# EAGLE design kicker-v2.2 (EAGLE 9.1.3)
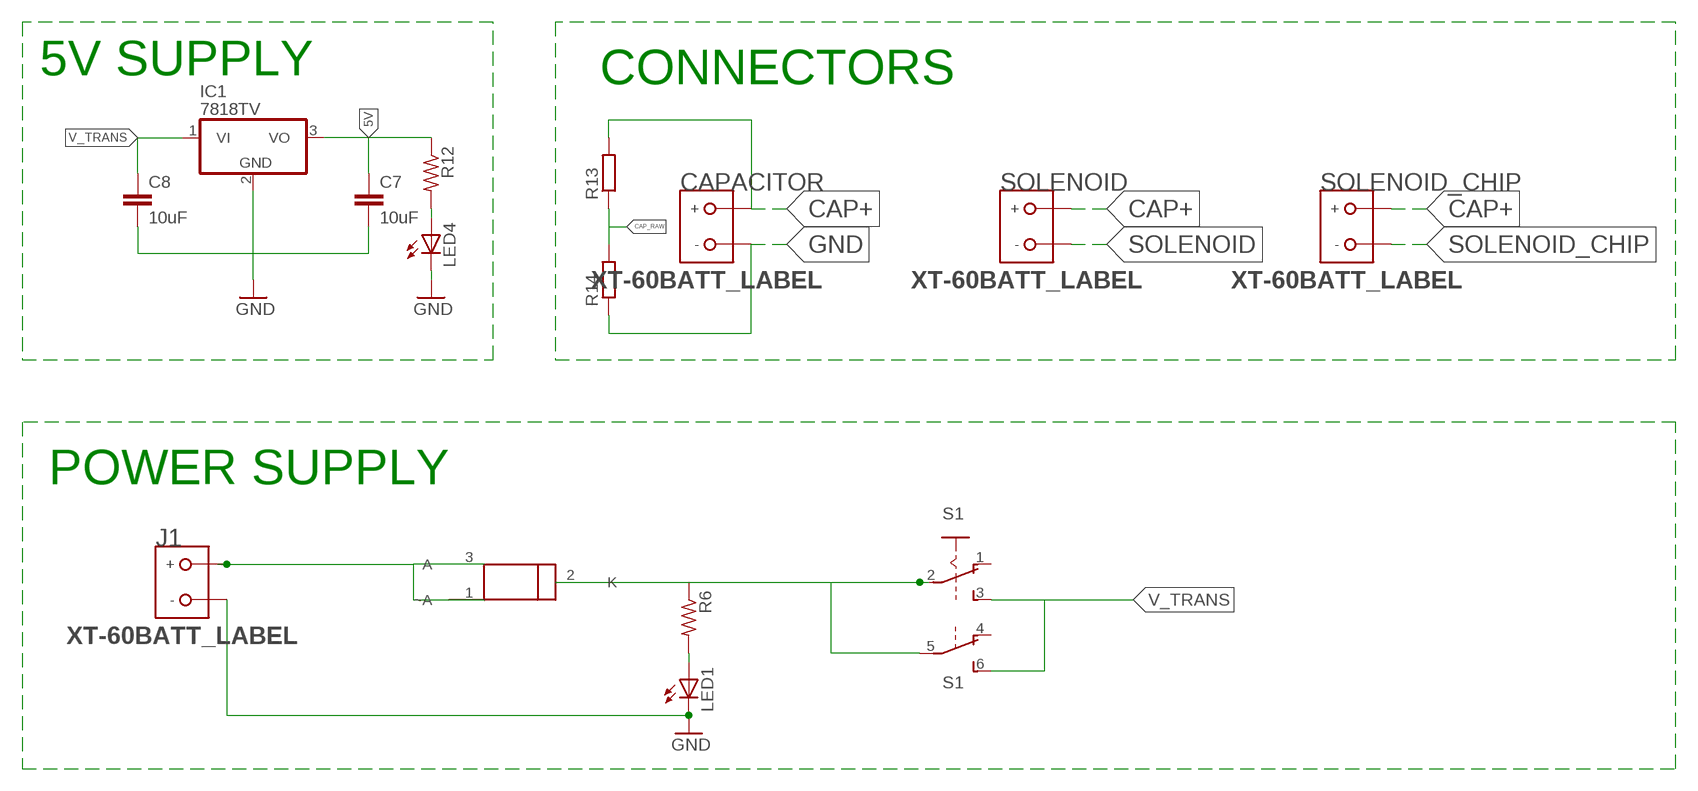
[diagram p0: schematic, sheet 1, part 1 of 2]
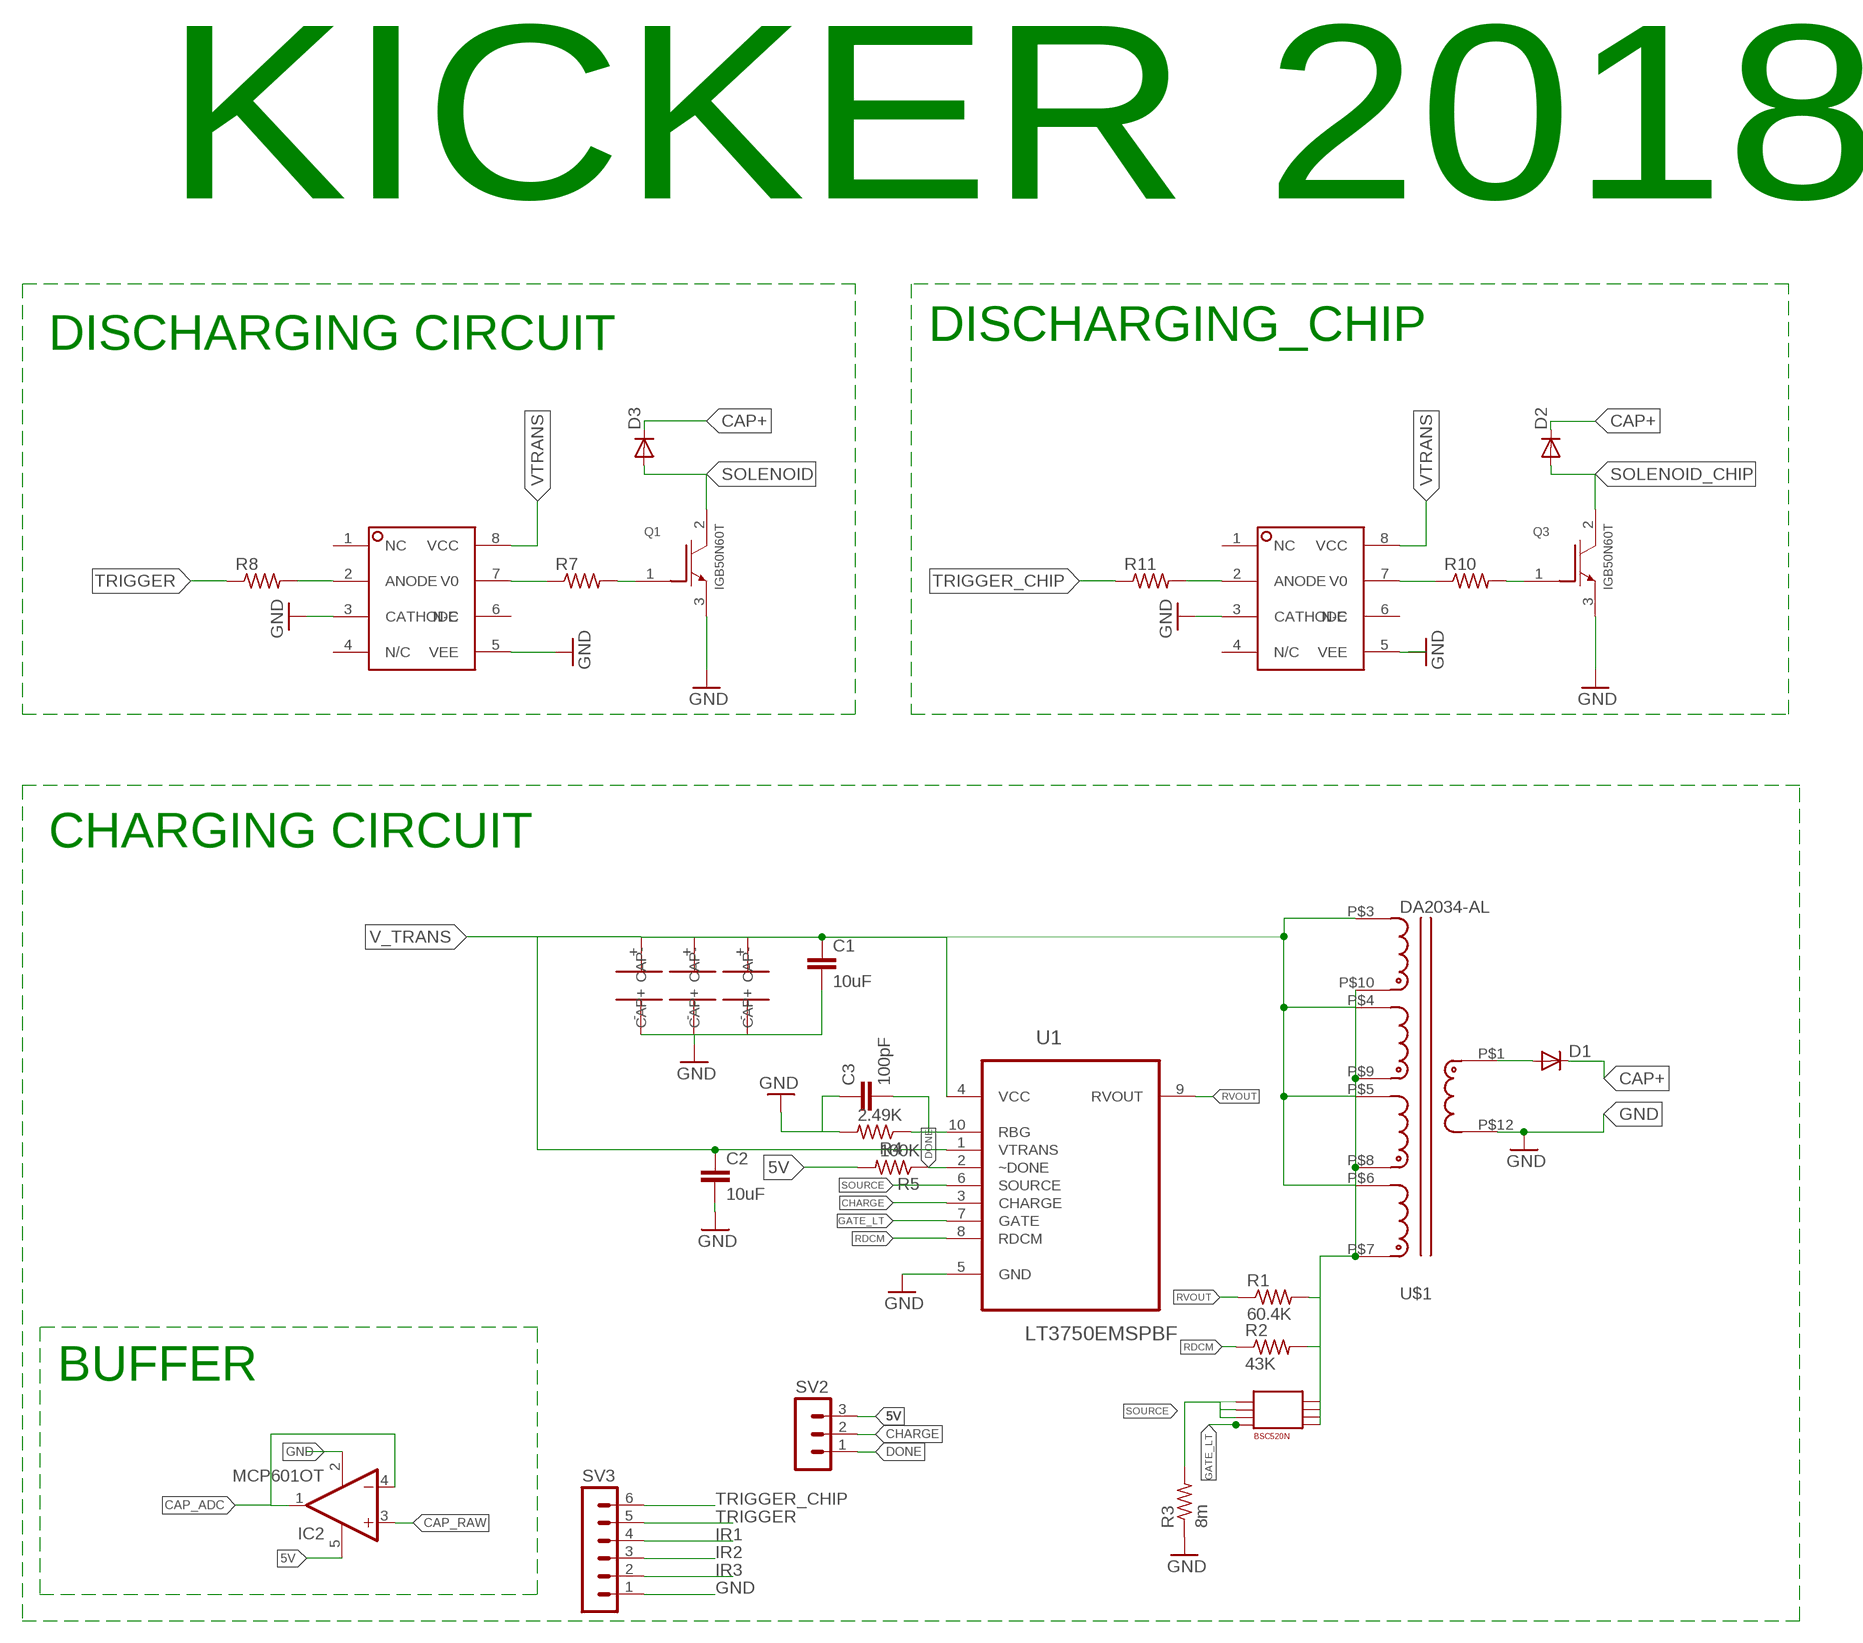
[diagram p1: schematic, sheet 1, part 2 of 2]

## Parts
C1  10uF  C-EUC1206  [C1206]
C2  10uF  C-EUC1206  [C1206]
C3  100pF  C-EUC1206  [C1206]
C7  10uF  C-EUC1206  [C1206]
C8  10uF  C-EUC1206  [C1206]
CAPACITOR  XT-60BATT_LABEL  [XT-60]
D1  DIODE-DO214AA  [DO214AA]
D2  DIODE-DO214AA  [DO214AA]
D3  DIODE-DO214AA  [DO214AA]
IC1  7818TV  [TO220V]
IC2  MCP601OT  [SOT23-5]
J1  XT-60BATT_LABEL  [XT-60]
LED1  LEDCHIPLED_1206  [CHIPLED_1206]
LED4  LEDCHIPLED_1206  [CHIPLED_1206]
Q1  IGB50N60T  [TO254P1524X457-3N-2-V]
Q3  IGB50N60T  [TO254P1524X457-3N-2-V]
R1  60.4K  R-US_M1206  [M1206]
R2  43K  R-US_M1206  [M1206]
R3  8m  R-US_M1206  [M1206]
R4  2.49K  R-US_M1206  [M1206]
R5  100K  R-US_M1206  [M1206]
R6  R-US_M1206  [M1206]
R7  R-US_M1206  [M1206]
R8  R-US_M1206  [M1206]
R10  R-US_M1206  [M1206]
R11  R-US_M1206  [M1206]
R12  R-US_M1206  [M1206]
R13  R-EU_R0805  [R0805]
R14  R-EU_R0805  [R0805]
S1  A68-A31  [A68-A31]
SOLENOID  XT-60BATT_LABEL  [XT-60]
SOLENOID_CHIP  XT-60BATT_LABEL  [XT-60]
SV2  MA03-1  [MA03-1]
SV3  MA06-1  [MA06-1]
U1  LT3750EMSPBF  [SOP50P490X110-10N]
U3  LP38690DT-3.3  [TO228P1042X238-3N]
U$1  DA2034-AL  [DA2034-AL]
U$2  56uF  CAP  [SVP_F12]
U$3  56uF  CAP  [SVP_F12]
U$4  56uF  CAP  [SVP_F12]
U$5  BSC520N  [PG-TDSON-8]
U$6  HCPL-3120-300E  [DIL08]
U$7  HCPL-3120-300E  [DIL08]

## Nets
5V: C7.1 IC1.3(VO) IC2.5(V+) R5.2 R12.1 SV2.3
CAP+: CAPACITOR.BATT(+) D1.C D2.C D3.C R13.2 SOLENOID.BATT(+) SOLENOID_CHIP.BATT(+)
CAP_ADC: IC2.1(OUT) IC2.4(-IN)
CAP_RAW: IC2.3(+IN) R13.1 R14.2
CHARGE: SV2.2 U1.3(CHARGE)
DONE: R5.1 SV2.1 U1.2(~DONE)
GATE_LT: U1.7(GATE) U$5.G
GND: C1.2 C2.2 C3.1 C7.2 C8.2 CAPACITOR.GND(-) IC1.2(GND) IC2.2(V-) J1.GND(-) LED1.C LED4.C Q1.3(EMITTER) Q3.3(EMITTER) R3.1 R4.2 R14.1 SV3.1 U1.5(GND) U$1.P$12 U$2.-(CAP-) U$3.-(CAP-) U$4.-(CAP-) U$6.3(CATHODE) U$6.5(VEE) U$7.3(CATHODE) U$7.5(VEE)
IR1: SV3.4
IR2: SV3.3
IR3: SV3.2
N$2: R7.1 U$6.7(V0)
N$4: C3.2 R4.1 U1.10(RBG)
N$7: R6.1 S1.2(A:P) S1.5(B:P) U3.2(K)
N$9: Q1.1(GATE) R7.2
N$10: R8.2 U$6.2(ANODE)
N$12: D1.A U$1.P$1
N$13: LED1.A R6.2
N$14: R10.1 U$7.7(V0)
N$15: Q3.1(GATE) R10.2
N$17: R11.2 U$7.2(ANODE)
N$21: LED4.A R12.2
RDCM: R2.1 U1.8(RDCM)
RVOUT: R1.1 U1.9(RVOUT)
SINK: R1.2 R2.2 U$1.P$7 U$1.P$8 U$1.P$9 U$1.P$10 U$5.D1 U$5.D2 U$5.D3 U$5.D4
SOLENOID: D3.A Q1.2(COLLECTOR) SOLENOID.GND(-)
SOLENOID_CHIP: D2.A Q3.2(COLLECTOR) SOLENOID_CHIP.GND(-)
SOURCE: R3.2 U1.6(SOURCE) U$5.S1 U$5.S2 U$5.S3
TRIGGER: R8.1 SV3.5
TRIGGER_CHIP: R11.1 SV3.6
V_TRANS: C1.1 C2.1 C8.1 IC1.1(VI) S1.3(A:S) S1.6(B:S) U1.1(VTRANS) U1.4(VCC) U$1.P$3 U$1.P$4 U$1.P$5 U$1.P$6 U$2.+(CAP+) U$3.+(CAP+) U$4.+(CAP+)
VIN: J1.BATT(+) U3.1(~A) U3.3(A)
VTRANS: U$6.8(VCC) U$7.8(VCC)
Unconnected: S1.1(A:O) S1.4(B:O) U$6.1(NC) U$6.4(N/C) U$6.6(N-C) U$7.1(NC) U$7.4(N/C) U$7.6(N-C)

## Notes on the sheet
- KICKER 2018
- DISCHARGING CIRCUIT | DISCHARGING_CHIP
- CHARGING CIRCUIT
- 5V SUPPLY | CONNECTORS
- POWER SUPPLY
- BUFFER

## Library data of the parts
C1-C3 C7 C8 = resistor:C-EU: CAPACITOR, European symbol
CAPACITOR J1 SOLENOID SOLENOID_CHIP = XT-60:XT-60: XT-60 Power Connector Distributor: HobbyKing <http://www.hobbyking.com/hobbyking/store/RC_PRODUCT_SEARCH.asp?strSearch=xt-60>
D1-D3 = diode:DIODE-: DIODE
IC1 = linear:78*: Positive VOLTAGE REGULATOR Source: http://cache.national.com/ds/LM/LM78L05.pdf http://www.fairchildsemi.com/ds/LM/LM7805.pdf
IC2 = linear:MCP601: Single Op Amp 2.7V to 6.0V Single Supply CMOS Source: http://ww1.microchip.com/downloads/en/DeviceDoc/21314g.pdf
LED1 LED4 = led:LED: LED OSRAM: - CHIPLED LG R971, LG N971, LY N971, LG Q971, LY Q971, LO R971, LY R971 LH N974, LH R974 LS Q976, LO Q976, LY Q976 LO Q996 - Hyper CHIPLED LW Q18S LB Q993, LB Q99A, LB R99A - SideLED LS A670, LO A670, LY A670, LG A670, LP A670 LB A673, LV A673, LT A673, LW A673 LH A674 LY A675 LS A676, LA A676, LO A676, LY A676, LW A676 LS A679, LY A679, LG A679 - Hyper Micro SIDELED® LS Y876, LA Y876, LO Y876, LY Y876 LT Y87S - SmartLED LW L88C, LW L88S LB L89C, LB L89S, LG L890 LS L89K, LO L89K, LY L89K LS L896, LA L896, LO L896, LY L896 - TOPLED LS T670, LO T670, LY T670, LG T670, LP T670 LSG T670, LSP T670, LSY T670, LOP T670, LYG T670 LG T671, LOG T671, LSG T671 LB T673, LV T673, LT T673, LW T673 LH T674 LS T676, LA T676, LO T676, LY T676, LB T676, LH T676, LSB T676, LW T676 LB T67C, LV T67C, LT T67C, LS T67K, LO T67K, LY T67K, LW E67C LS E67B, LA E67B, LO E67B, LY E67B, LB E67C, LV E67C, LT E67C LW T67C LS T679, LY T679, LG T679 LS T770, LO T770, LY T770, LG T770, LP T770 LB T773, LV T773, LT T773, LW T773 LH T774 LS E675, LA E675, LY E675, LS T675 LS T776, LA T776, LO T776, LY T776, LB T776 LHGB T686 LT T68C, LB T68C - Hyper Mini TOPLED® LB M676 - Mini TOPLED Santana® LG M470 LS M47K, LO M47K, LY M47K Source: http://www.osram.convergy.de LUXEON: - LUMILED® LXK2-PW12-R00, LXK2-PW12-S00, LXK2-PW14-U00, LXK2-PW14-V00 LXK2-PM12-R00, LXK2-PM12-S00, LXK2-PM14-U00 LXK2-PE12-Q00, LXK2-PE12-R00, LXK2-PE12-S00, LXK2-PE14-T00, LXK2-PE14-U00 LXK2-PB12-K00, LXK2-PB12-L00, LXK2-PB12-M00, LXK2-PB14-N00, LXK2-PB14-P00, LXK2-PB14-Q00 LXK2-PR12-L00, LXK2-PR12-M00, LXK2-PR14-Q00, LXK2-PR14-R00 LXK2-PD12-Q00, LXK2-PD12-R00, LXK2-PD12-S00 LXK2-PH12-R00, LXK2-PH12-S00 LXK2-PL12-P00, LXK2-PL12-Q00, LXK2-PL12-R00 Source: www.luxeon.com KINGBRIGHT: KA-3528ASYC Source: www.kingbright.com
Q1 Q3 = IGB50N60T:IGB50N60T: IGB50N60T Low Loss IGBT: IGBT in TRENCHSTOP and Fieldstop technology, IC 50A TO254P1524X457-3N-2-V
R1-R8 R10-R12 = resistor:R-US_: RESISTOR, American symbol
R13 R14 = resistor:R-EU_: RESISTOR, European symbol
S1 = switch:A68-A31: SLIDING SWITCH Siemens, distributor Buerklin, 11G766
SV2 = con-lstb:MA03-1: PIN HEADER; OC_FARNELL: unknown; OC_NEWARK: unknown
SV3 = con-lstb:MA06-1: PIN HEADER; OC_FARNELL: unknown; OC_NEWARK: unknown
U1 = LT3750-element:LT3750EMSPBF: Capacitor Charger Controller; MPN: LT3750EMS#PBF; OC_FARNELL: 1273500; OC_NEWARK: 57M8591; PACKAGE: MSOP-10; SUPPLIER: Linear Technology
U3 = LP38690DT-3.3:LP38690DT-3.3; MPN: LP38690DT-3.3; OC_FARNELL: 1008048; OC_NEWARK: 41K7439; PACKAGE: TO-252; SUPPLIER: National Semiconductor
U$1 = inductor-coilcraft-2:DA2034-AL: Flyback Transformer for Linear Technology LT3750 Reference: http://www.coilcraft.com/da2032.cfm L - 10 uH TurnsRatio Pri:Sec - 1:10 Ipeak - 10.0 A Interwinding capacitance - 128 pF DCRmax: Pri - 0.018, Sec - 1.75 Ohms
U$2-U$4 = SVP_F12:CAP
U$5 = BSC520N:BSC520N
U$6 U$7 = adafruit:HCPL-3120-300E

## Board
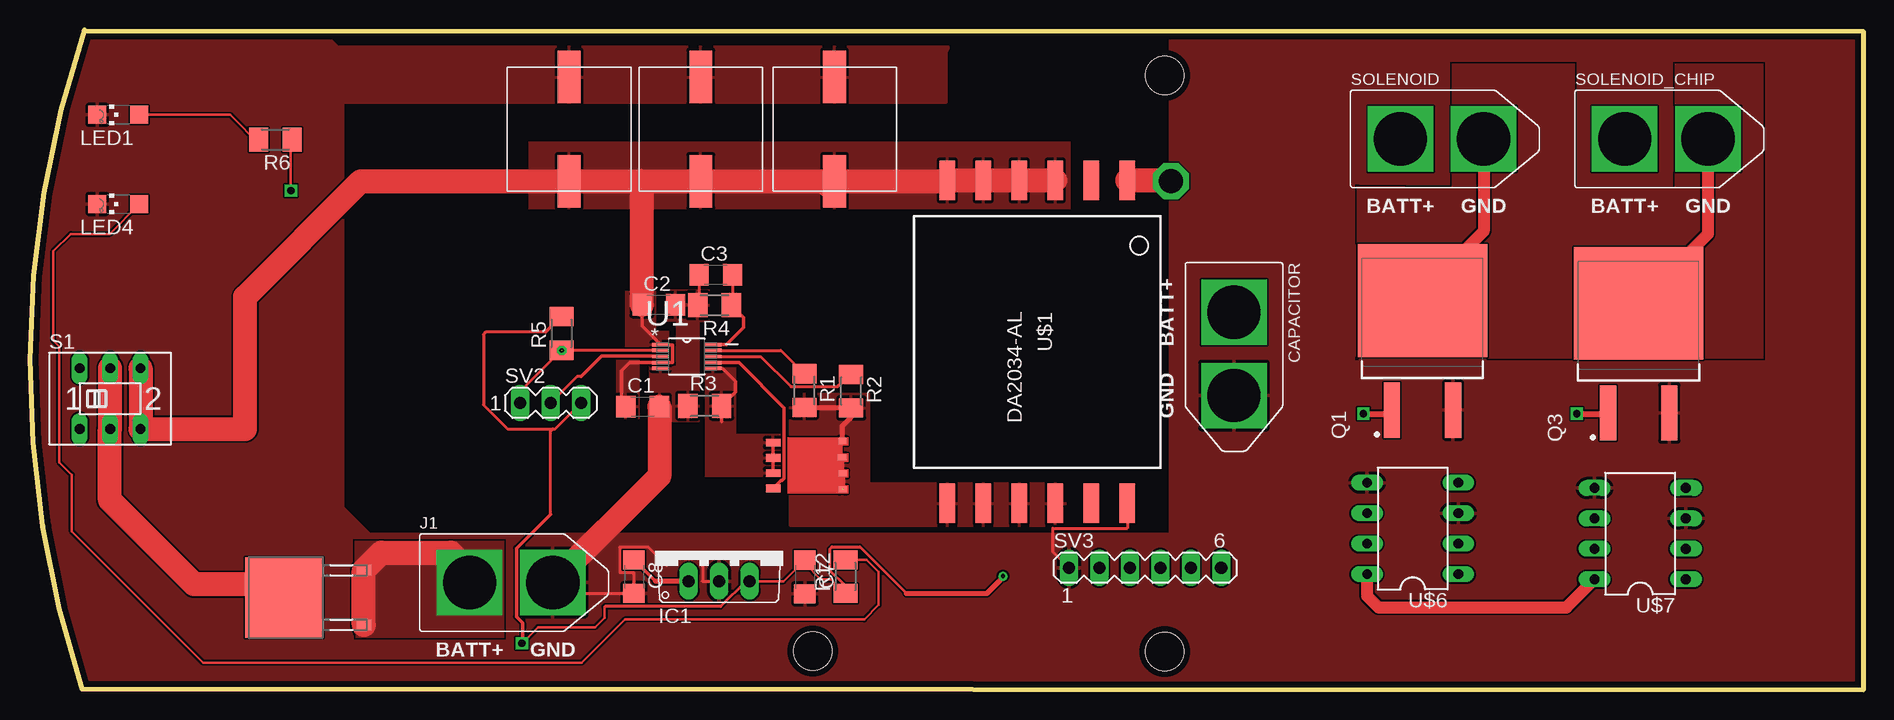
[diagram p2: board, top side]
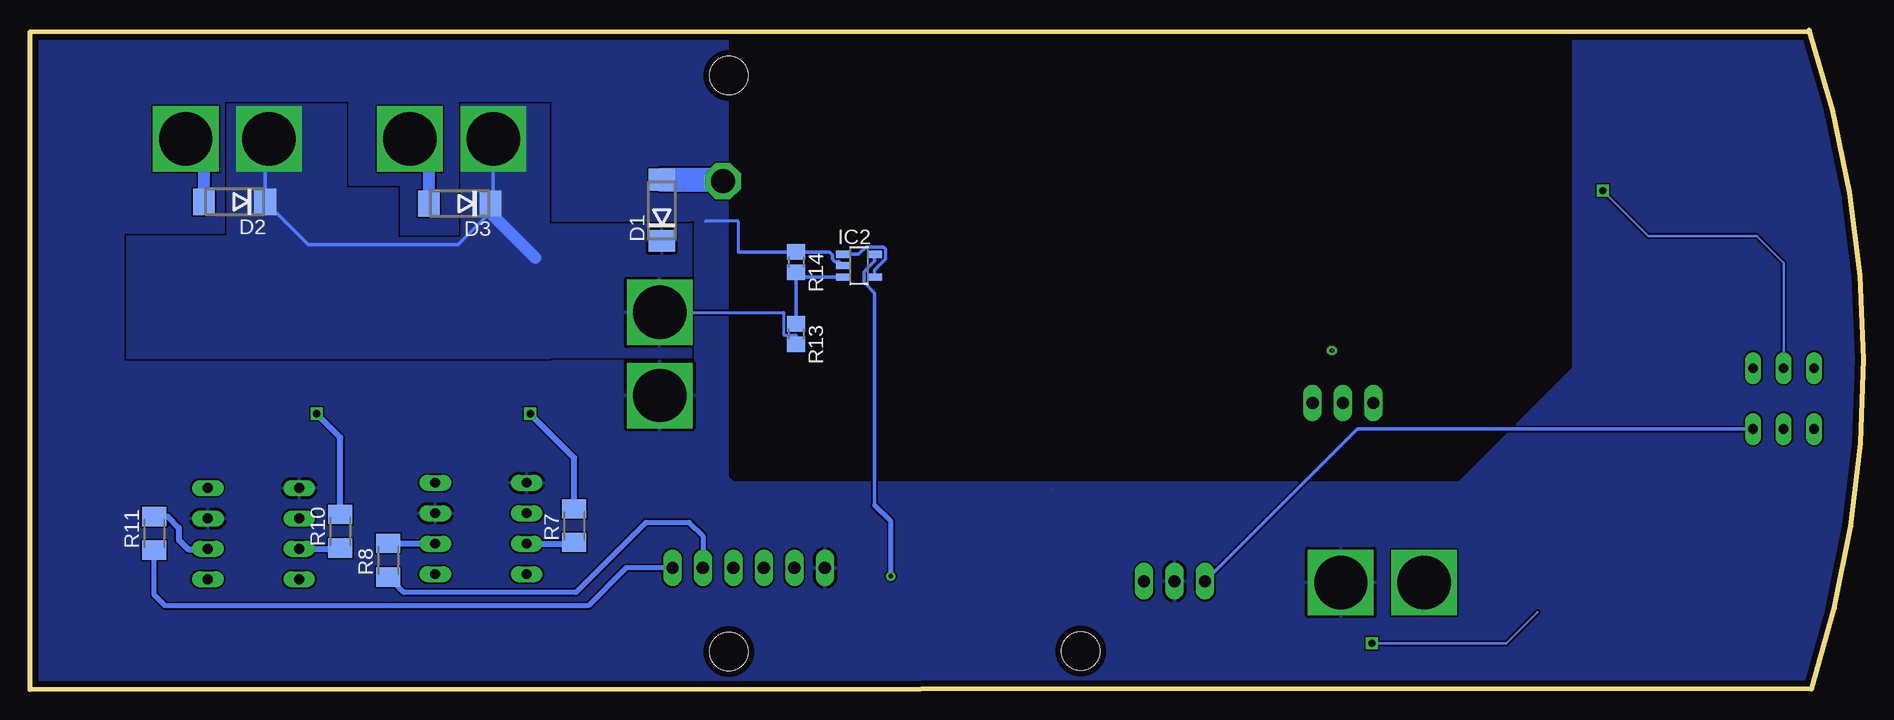
[diagram p3: board, bottom side, seen from below]

Size 152.85 x 55 mm. Coordinates in mm from the lower left corner, seen from the top.
Outline: 4.55,55 arc37 4.35,0.05 152.85,0 152.85,54.85 4.5,54.9
Copper layers (1*16): Top 0.09mm / dielectric 2.2mm / Bottom 0.09mm
Design rules "default *": minimum track width 10mil, minimum drill 0.15mm, track to track 0.15mm, track to pad 0.15mm, pad to pad 0.15mm, via to via 0.15mm, smd to smd 0.15mm, copper to edge 0.5mm, drill to drill 8mil, minimum pad ring 10mil, minimum via ring 8mil, stop-mask expansion 4mil, vias tented up to drill 0mil, thermal gap 10mil
Holes 3.2 mm at 65.25,3.2 65.95,-16.55 94.6,51.2 94.6,3.15

### Footprints (pad centres in the part's own frame; a part is rotated, then mirrored left to right if it is on the bottom)
C1206 = smd 1.6 x 1.8: 1 -1.4,0; 2 1.4,0
XT-60 = drill 4.446 square: BATT 0,4.154; GND 0,11.092
DO214AA = smd 1.8 x 2.2: A 2.55,0; C -2.55,0
TO220V = drill 1.016 long: 1 -2.54,-2.54; 2 0,-2.54; 3 2.54,-2.54
SOT23-5 = smd 0.6 x 1.2: 1 -0.95,-1.306; 2 0,-1.306; 3 0.95,-1.306; 4 0.95,1.306; 5 -0.95,1.306
CHIPLED_1206 = smd 1.5 x 1.5: A 0,-1.75; C 0,1.75
TO254P1524X457-3N-2-V = smd 4.6 x 1.35: 1 -4.575,2.55; 3 -4.575,-2.55 | smd 9.4 x 10.8: 2 4.575,0
M1206 = smd 1.6 x 2: 1 -1.4,0; 2 1.4,0
R0805 = smd 1.3 x 1.5: 1 -0.85,0; 2 0.85,0
A68-A31 = drill 0.813 long: 1 -2.54,-2.54; 2 0,-2.54; 3 2.54,-2.54; 4 -2.54,2.54; 5 0,2.54; 6 2.54,2.54
MA03-1 = drill 1.016 long: 1 -2.54,0; 2 0,0; 3 2.54,0
MA06-1 = drill 1.016 long: 1 -6.35,0; 2 -3.81,0; 3 -1.27,0; 4 1.27,0; 5 3.81,0; 6 6.35,0
SOP50P490X110-10N = smd 1.397 x 0.279: 1 -2.184,0.991; 2 -2.184,0.508; 3 -2.184,0; 4 -2.184,-0.508; 5 -2.184,-0.991; 6 2.184,-0.991; 7 2.184,-0.508; 8 2.184,0; 9 2.184,0.508; 10 2.184,0.991
TO228P1042X238-3N = smd 0.889 x 1.219: 1 -2.286,-6.502; 3 2.286,-6.502 | smd 6.731 x 6.502: 2 0,0.152
DA2034-AL = smd 3.3 x 1.27: P$1 -13.46,7.5; P$2 -13.46,4.5; P$3 -13.46,1.5; P$4 -13.46,-1.5; P$5 -13.46,-4.5; P$6 -13.46,-7.5; P$7 13.46,-7.5; P$8 13.46,-4.5; P$9 13.46,-1.5; P$10 13.46,1.5; P$11 13.46,4.5; P$12 13.46,7.5
SVP_F12 = smd 1.9 x 4.4: + 5.15,-0.8; - 5.15,-9.5
PG-TDSON-8 = smd 0.5 x 0.7: D1 -0.12,5.78; D2 1.25,5.75; D3 2.58,5.81; D4 3.9,5.79 | smd 0.65 x 1.2: G 3.81,0; S1 0,0; S2 1.27,0; S3 2.54,0
DIL08 = drill 0.813 long: 1 -3.81,-3.81; 2 -1.27,-3.81; 3 1.27,-3.81; 4 3.81,-3.81; 5 3.81,3.81; 6 1.27,3.81; 7 -1.27,3.81; 8 -3.81,3.81

### Placement (x,y rotation side)
C1  51.06,23.6 0 top
C2  52.41,32.09 0 top
C3  57.16,34.59 0 top
C7  64.59,9.39 270 top
C8  50.35,9.41 270 top
CAPACITOR  100.36,35.61 180 top
D1  100.18,39.97 90 bottom
D2  135.8,40.67 180 bottom
D3  117.04,40.52 180 bottom
IC1  57.45,11.57 0 top
IC2  83.75,35.35 270 bottom
J1  32.49,8.92 270 top
LED1  7.37,47.93 90 top
LED4  7.37,40.49 90 top
Q1  116.07,27.87 90 top
Q3  134.09,27.64 90 top
R1  64.55,24.93 270 top
R2  68.45,24.88 270 top
R3  56.24,23.65 0 top
R4  57.06,32.05 180 top
R5  44.3,29.7 90 top
R6  20.46,45.87 180 top
R7  107.48,13.66 90 bottom
R8  122.98,10.78 90 bottom
R10  126.98,13.2 90 bottom
R11  142.48,13.02 90 bottom
R12  67.97,9.42 90 top
R13  89,29.65 270 bottom
R14  89,35.65 270 bottom
S1  6.68,24.26 0 top
SOLENOID  110.08,45.92 270 top
SOLENOID_CHIP  128.78,45.92 270 top
SV2  43.4,23.9 0 top
SV3  92.95,10.15 0 top
U1  54.75,27.77 0 top
U3  21.33,7.67 90 top
U$1  83.96,29 270 top
U$2  61.06,41.58 180 top
U$3  50.09,41.58 180 top
U$4  72.22,41.58 180 top
U$5  61.95,20.59 270 top
U$6  115.26,13.43 90 top
U$7  134.22,13 90 top

### Tracks (layer width: path | path; a pad name or v marks a point on that pad's centre or on a via)
5V  (via drill 0.35, 0.6)
  Top 0.2: IC1.3 62.83,9.03 C7.1 64.59,10.51 65.9,9.2 66.79,9.2 R12.1 | 47.9,6.9 47.9,6 47.1,5.2 42.35,5.2 41.05,3.9 v41,3.85
  Top 0.254: 73.06,8.02 69.18,11.9 66.85,11.9 66.69,11.74 66.69,9.91 67.97,8.63 R12.1 | IC1.3 59.68,9.03 57.58,6.93 47.93,6.93 47.9,6.9 | 43,29.8 38,29.8 37.8,29.6 37.8,23.75 39.8,21.75 43.6,21.75 | 43.6,21.75 43.79,21.75 SV2.3 | 43.39,14.61 43.39,21.54 43.6,21.75
  Top 0.3: R5.2 43,29.8 | 41.05,3.9 41.05,5.57 40.55,6.07 40.55,11.78 43.39,14.61 43.4,14.62
  Top 0.4: 73.06,8.02 79.77,8.02 81.1,9.35 v81.1,9.45
  Bottom 0.2: v41,3.85 29.8,3.85 27.2,6.45
  Bottom 0.3: IC2.5 82.44,35.72 83.08,35.08 83.34,34.82 83.34,33.98 82.44,33.08 82.44,15.37
  Bottom 0.4: v81.1,9.45 81.1,14.02 82.44,15.37
CAP+
  Bottom 0.254: R13.2 89,29.57 90.03,29.57 90.03,31.46 CAPACITOR.BATT
  Bottom 0.3: SOLENOID.BATT 114.23,40.78 D3.C 114.49,39.76 117.15,37.1 129.68,37.1 D2.C 133.25,45.61 SOLENOID_CHIP.BATT
  Bottom 1: 110.72,35.99 114.49,39.76
  pour Bottom (no thermals): 109.55,27.6 109.55,38.55 109.55,48.8 116.95,48.8 116.95,37.7 122.15,37.7 122.15,41.8 126.45,41.8 126.45,48.8 136.45,48.8 136.45,37.8 144.85,37.8 144.85,27.6
  pour Bottom: 97.7,38.8 97.7,27.65 116.3,27.65 116.3,38.85 97.65,38.85
CAP_ADC
  Bottom 0.3: IC2.4 82.44,34.98 81.54,35.88 81.54,36.72 81.72,36.9 83.17,36.9 83.77,36.3 IC2.1
CAP_RAW
  Bottom 0.2: 88.6,34.4 88.77,34.58 R14.2
  Bottom 0.3: IC2.3 88.6,34.4 88.77,34.58 | R14.2 R13.1
CHARGE
  Top 0.254: 45.94,26.09 45.59,26.09 SV2.2
  Top 0.3: 45.94,26.09 47.65,27.8 52.53,27.8 U1.3
DONE  (via drill 0.35)  (1 unrouted)
  Top 0.254: U1.2 v44.35,28.28 | R5.1 40.86,24.86 SV2.1
  Top 0.3: R5.1 44.32,28.28 v44.35,28.28
  other vias: 44.3,28.28
GATE_LT
  Top 0.3: U1.7 59.09,27.26 62.85,23.5 62.85,17.6 62.67,17.43 62.59,17.43 U$5.G
GND
  Top 0.254: U$1.P$12 91.46,13.45 85.27,13.45 85.27,11.48 SV3.1 | J1.GND 43.58,8.01 C8.2 50.35,9.73 49.17,9.73 49.17,11.89 51.53,11.89 53.07,10.34 53.77,11.03 56.05,11.03 56.05,9.03 IC1.2 | 45.6,51.05 44.94,51.05 U$3.- | C3.1 55.76,32.05 R4.2
  Top 2: C1.2 52.46,17.8 J1.GND
  Bottom 0.254: 93.81,36.5 93.81,39.05 96.55,39.05
  Bottom 0.3: IC2.2 85.4,35.7 85.78,35.7 85.95,35.88 85.95,36.25 86.2,36.5 R14.1 93.81,36.5
  pour Top: 55.8,22.35 55.8,30.7 56.65,30.7 56.65,33.3 52.9,33.3 52.9,30.75 53.85,30.75 53.85,26.95 51.6,26.95 51.6,22.35
  pour Top (rank 5): 19.75,59.45 26.05,53.15 26.05,15.2 28.3,12.95 95.05,12.95 95.05,55 97.9,57.85 153.8,57.85 157.1,54.55 157.1,-0.95 150.55,-7.5 -11.1,-7.5 -34.9,16.3 -34.9,59.5 -29.55,64.85 14.4,64.85 19.75,59.5
  pour Bottom (rank 5): 0.2,61.95 24.15,61.95 24.15,26.8 33.7,17.25 94.25,17.25 94.75,17.75 94.75,59.15 100.95,65.35 162.15,65.35 165.55,68.75 165.55,-32.3 164.7,-33.15 27.6,-33.15 -20.2,14.65 -20.2,41.25 0.35,61.8
  pour Top: 76.6,53.55 18.35,53.55 18.35,49 76.4,49 76.4,53.2
N$2
  Bottom 0.5: U$6.7 107.58,12.16 R7.1
N$3
  pour Top (no thermals): 118.55,41.9 118.55,52.2 128.75,52.2 128.75,41.8 137.15,41.8 137.15,52.2 144.45,52.2 144.45,27.6 110.65,27.6 110.65,42
N$4
  Top 0.254: C3.2 58.56,32.05 R4.1
  Top 0.3: U1.10 58.06,28.76 59.5,30.2 59.5,31.01 R4.1
N$7  (via drill 0.6)
  Top 0.2: v21.75,41.6 21.75,45.76 R6.1
  Top 2: U3.2 22.28,8.77 13.68,8.77 6.65,15.8 6.65,21.69 S1.2 S1.5
  Bottom 0.2: S1.5 6.68,35.58 8.9,37.8 17.95,37.8 v21.75,41.6
N$9  (via drill 0.6)
  Top 0.5: v111.15,23 113.22,23 Q1.1
  Bottom 0.5: R7.2 107.48,19.33 v111.15,23
N$10
  Bottom 0.5: U$6.2 122.96,12.16 R8.2
N$12  (via drill 2)
  Top 2: U$1.P$1 95.04,42.46 v95.1,42.4
  Bottom 2: D1.A 95.22,42.52 v95.1,42.4
N$13
  Top 0.2: LED1.A 16.67,47.93 19.25,45.35 19.25,45.68 R6.2
N$14
  Bottom 0.5: U$7.7 127.05,11.73 R10.1
N$15  (via drill 0.6)
  Top 0.5: v128.95,23 131.47,23 Q3.1
  Bottom 0.5: R10.2 126.98,21.03 v128.95,23
N$17
  Bottom 0.5: R11.2 141.37,14.42 140.45,13.5 140.45,12.5 139.65,11.7 138.06,11.7 U$7.2
N$21
  Top 0.2: R12.2 69.73,10.82 70.75,9.8 70.75,7.05 69.55,5.85 49.6,5.85 46,2.25 14.45,2.25 3.5,13.2 3.5,17.9 2.45,18.95 2.45,28.6 1.95,29.1 1.95,36.55 3.4,38 6.63,38 LED4.A
RDCM
  Top 0.254: 67.33,25.25 63.43,25.25 60.92,27.77 U1.8
  Top 0.3: 67.33,25.25 R2.1
RVOUT
  Top 0.254: U1.9 62.6,28.28 64.53,26.35
  Top 0.3: 64.53,26.35 R1.1
SINK  (1 unrouted)
  Top 0.406: 67.76,16.69 U$5.D3 67.7,18.01 U$5.D2 67.73,19.34 | R1.2 64.55,23.48 R2.2 68.4,23.43 68.4,22.65 67.73,21.98 U$5.D1
  pour Top: 63.35,24.6 63.35,13.7 86.3,13.7 86.3,17.15 69.95,17.15 69.95,24.65
SOLENOID
  Top 1: SOLENOID.GND 121.17,38.22 116.15,33.2 116.15,32.52 Q1.2
  Bottom 1: D3.A 119.59,44.34 SOLENOID.GND
SOLENOID_CHIP
  Top 1: SOLENOID_CHIP.GND 139.87,38 Q3.2
  Bottom 1: D2.A 138.35,44.4 SOLENOID_CHIP.GND
SOURCE
  Top 0.3: U1.6 57.72,26.78 58.8,25.7 58.8,24.81 R3.2 57.64,22.36 | U$5.S3 U$5.S2 U$5.S1
  pour Top: 56.25,26.85 58.8,26.85 58.8,21.3 62.6,21.3 62.6,17.75 56.3,17.75 56.3,26.8
TRIGGER
  Bottom 0.4: R8.1 121.7,8.1 107.35,8.1 101.5,13.95 97.9,13.95 96.75,12.8 SV3.5
TRIGGER_CHIP
  Bottom 0.4: R11.1 142.5,11.6 142.5,7.9 141.6,7 106.3,7 103.4,9.9 103.15,10.15 SV3.6
V_TRANS
  Top 0.3: 49.3,23.96 49.3,26.6 49.96,27.26 U1.4 53.56,27.26 53.56,28.72 53.55,28.72 53.55,28.75 52.62,28.75 52.62,28.8 U1.1 51.01,30.32 C2.1 | 52.13,9.03 C8.1
  Top 0.4: IC1.1 52.13,9.03
  Top 0.5: 49.3,23.96 C1.1
  Top 2: S1.6 S1.3 17.93,21.72 17.93,32.73 27.58,42.38 U$3.+ 50.9,42.38 | 50.9,42.38 U$2.+ 66.17,42.38 66.45,42.1 66.79,42.1 U$4.+ 76.38,42.38 U$1.P$6 U$1.P$5 U$1.P$4 U$1.P$3 | C2.1 51.01,42.38 50.9,42.38
  Bottom 0.3: IC1.1 42.22,21.72 S1.3
  pour Top: 50.8,22.6 50.8,27.45 48.85,27.45 48.85,22.6
  pour Top: 53.25,28.5 49.65,28.5 49.65,33.25 52.15,33.25 52.15,29.9 53.25,29.9 53.25,28.55
  pour Top: 41.55,45.6 41.55,40.1 86.75,40.1 86.75,45.65 41.55,45.65
VIN
  Top 2: U3.1 U3.3 29.27,11.4 35.1,11.4 36.64,9.86 J1.BATT
  pour Top (no thermals): 27.1,4.7 27.1,12.4 39.5,12.4 39.5,4.3 27.2,4.3 27.2,4.7
VTRANS
  Top 1: U$6.8 111.45,7.8 112.4,6.85 128.07,6.85 U$7.8

### Text on the board
tPlace: KRSSG